# Altium schematic sheet TMP75C.SchDoc
size A4
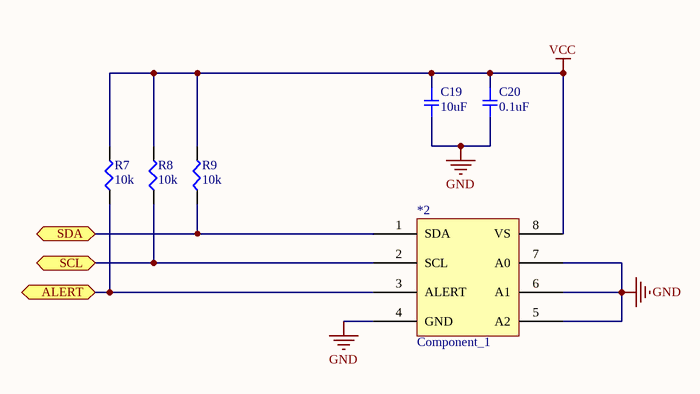
[diagram p0: TMP75C.SchDoc]

## Parts
*2  Component_1  [TMP75C]
C19  10uF  [SMD-0805C]
C20  0.1uF  [SMD-0805C]
R7  10k  [SMD-0805-RES]
R8  10k  [SMD-0805-RES]
R9  10k  [SMD-0805-RES]

## Ports
ALERT, SCL, SDA

## Nets
GND: *2.4(GND) *2.5(A2) *2.6(A1) *2.7(A0) C19.2 C20.2
VCC: *2.8(VS) C19.1 C20.1 R7.2 R8.2 R9.2
ALERT: *2.3(ALERT) R7.1 ; port ALERT
SCL: *2.2(SCL) R8.1 ; port SCL
SDA: *2.1(SDA) R9.1 ; port SDA

## Library data of the parts
C19 = CL21A106KAFN3NE: Cap Ceramic 10uF 25V X5R 10% 0805; Manufacturer: Samsung Electro-Mechanics; Part Number: CL21A106KAFN3NE; Package / Case: 0805; Voltage: 25V; Tolerance: 10%; VALUE: 10uF
C20 = CL21B104JBCNNNC: CAP CER 0.1uF 50V X7T 0805; Part Number: GC321AD72E103KX01D; Manufacturer: Samsung Electro-Mechanics; Tolerance: 5%; Package / Case: 0805; Voltage: 50V; VALUE: 0.1uF
R7-R9 = ERJ-P6WJ103V: RES SMD 10K OHM 5% 1/2W 0805; Manufacturer: Panasonic Electronic Components; Factory Stock: 0; Unit Price (USD): 0.08237; @ qty: 1500; Minimum Quantity: 1; Power (Watts): 0.5W, 1/2W; Temperature Coefficient: ±200ppm/°C; Part Number: ERJ-P6WJ103V; Datasheets: https://industrial.panasonic.com/cdbs/www-data/pdf/RDA0000/AOA0000C243.pdf; Image: //media.digikey.com/Renders/Panasonic%20Renders/ERJ-0805%20Pkg.jpg; Digi-Key Part Number: P16966CT-ND; Quantity Available: 2796; Packaging: Cut Tape (CT); Series: ERJ; Part Status: Active; Value: 10k; Tolerance: ±5%; Composition: Thick Film; Features: Automotive AEC-Q200, Pulse Withstanding; Operating Temperature: -55°C ~ 155°C; Package / Case: 0805 (2012 Metric); Supplier Device Package: 0805; Size / Dimension: 0.079" L x 0.049" W (2.00mm x 1.25mm); Height - Seated (Max): 0.030" (0.75mm); Number of Terminations: 2; Failure Rate: -